# EasyEDA Pro project 射频跟随.epro

# Schematic Schematic7
Board Name: 射频跟随; Create Date: 2025-07-16; Page Name: P1; Project Name: 直流偏置电路; Schematic Name: Schematic7; Update Date: 2025-07-16; Company: 嘉立创EDA; Page Size: A4; Version: V1.0
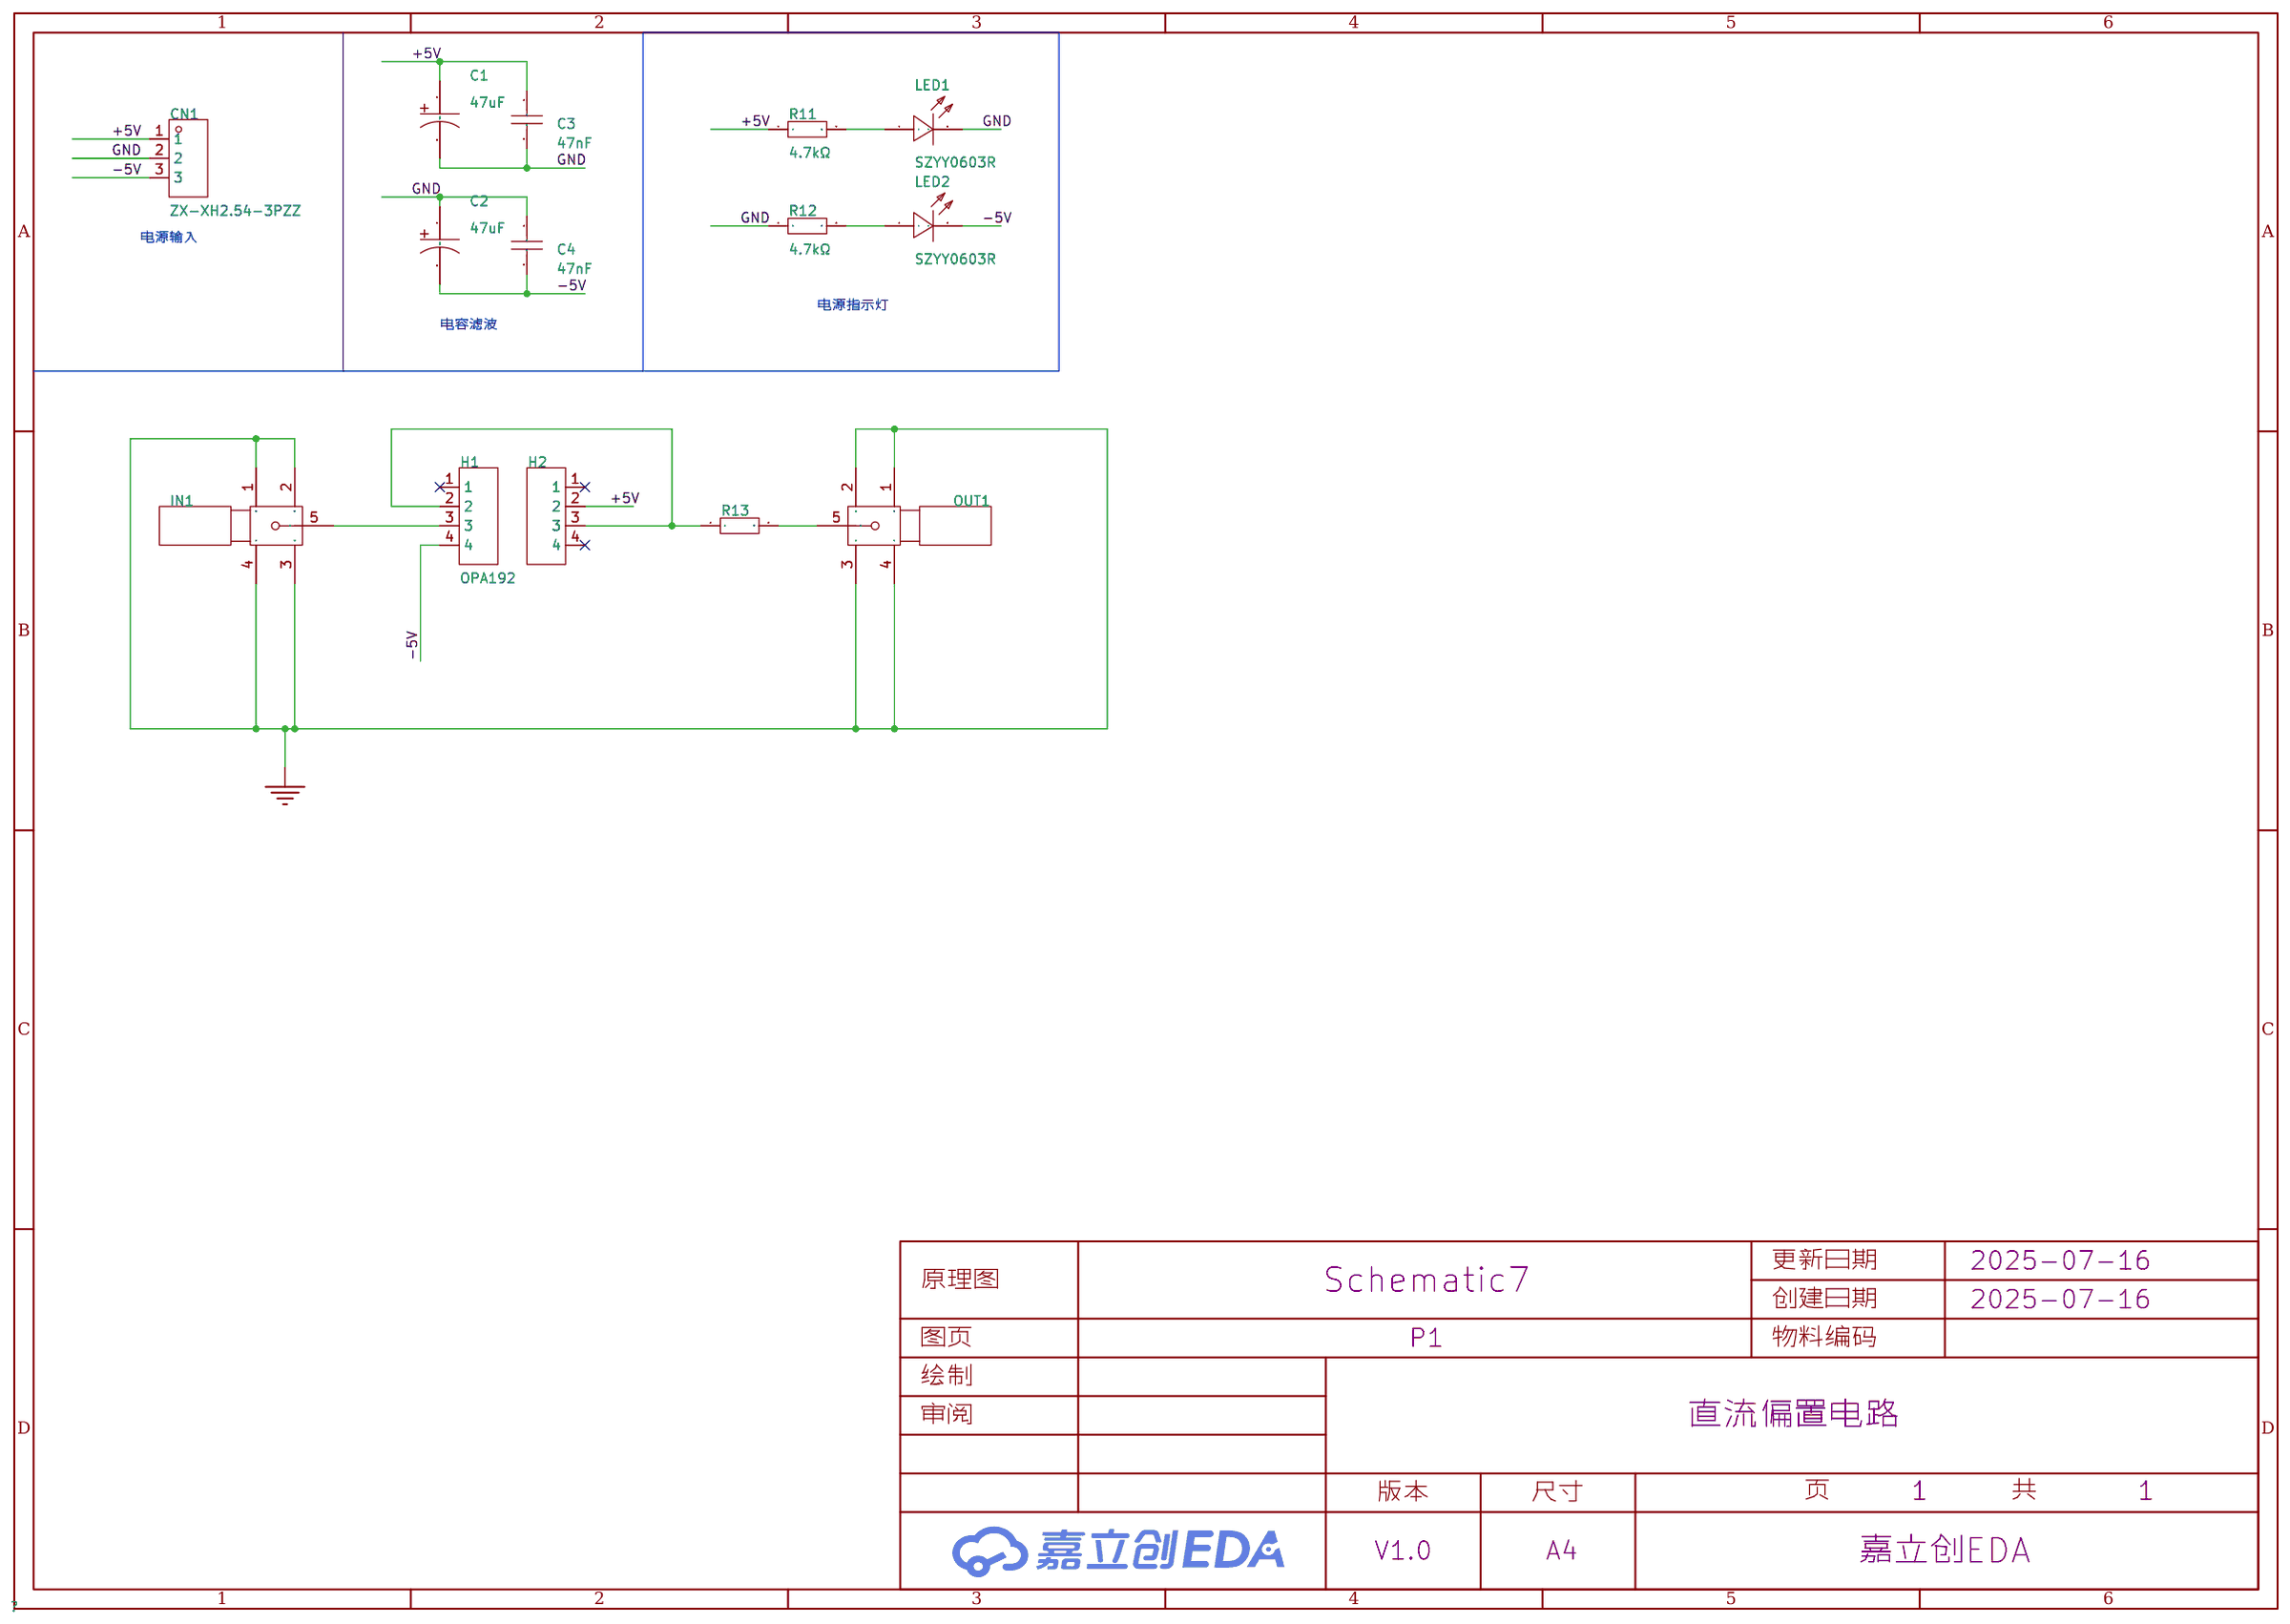
[diagram p0: schematic sheet]

## Parts
C1  47uF  [CAP-TH_BD5.0-P2.00-D0.8-FD]
C2  47uF  [CAP-TH_BD5.0-P2.00-D0.8-FD]
C3  47nF  [C0805]
C4  47nF  [C0805]
CN1  ZX-XH2.54-3PZZ  [CONN-TH_3P-P2.54_2501S-3P]
H1  OPA192  [HDR-TH_4P-P2.54-V-F]
H2  HC-PM254-5.0H-1x4PZ-02A  [HDR-TH_4P-P2.54-V-F]
IN1  -  [SMA-SMD_BWSMA-KE-P001]
LED1  SZYY0603R  [LED0603-R-RD]
LED2  SZYY0603R  [LED0603-R-RD]
OUT1  -  [SMA-SMD_BWSMA-KE-P001]
R11  4.7kΩ  [R0805]
R12  4.7kΩ  [R0805]
R13  0805W8F200JT5E  [R0805]

## Library data of the parts
C1 C2 = NXB25V47M5*11 2.5TP: 容值:47uF;精度:±20%;额定电压:25V;纹波电流:250mA@100kHz;等效串联电阻(ESR):300mΩ@100kHz;; LCSC Part Name: 47uF ±20% 25V; Supplier Part: C371230; Manufacturer: SAMYOUNG(韩国三莹); Supplier Footprint: 插件,D5xL11mm; JLCPCB Part Class: 扩展库; Datasheet: https://atta.szlcsc.com/upload/public/pdf/source/20190227/C371244_FA85FFEFC2961227CF12E3CCE8C34A7D.pdf; Supplier: LCSC; Tolerance: ±20%; Voltage Rating: 25V; Ripple Current: 250mA@100kHz; Equivalent Series Resistance(ESR): 300mΩ@100kHz; Pin Spacing: 2mm; Diameter: 5mm; Height - Seated (Max): 11mm; Lifetime: 2000hrs@105℃; Operating Temperature: -40℃~+105℃
C3 C4 = CL21B473KBCNNNC: 容值:47nF;精度:±10%;额定电压:50V;材质(温度系数):X7R;; LCSC Part Name: 47nF ±10% 50V; Supplier Part: C53134; Manufacturer: SAMSUNG(三星); Supplier Footprint: 0805; JLCPCB Part Class: 基础库; Datasheet: https://atta.szlcsc.com/upload/public/pdf/source/20160218/1457707763339.pdf; Supplier: LCSC; Tolerance: ±10%; Voltage Rated: 50V; Temperature Coefficient: X7R
CN1 = ZX-XH2.54-3PZZ: 插针结构:1x3P;间距:2.5mm;安装方式:直插;参考系列:XH;总PIN数:3P;排数:1;每排PIN数:3;行距:-;额定电流:3A;触头材质:黄铜;触头镀层:锡;工作温度范围:-25℃~+85℃;; LCSC Part Name: 1x3P 间距:2.5mm 直插 系列:XH; Supplier Part: C7429633; Manufacturer: Megastar(兆星); Supplier Footprint: 插件,P=2.5mm; JLCPCB Part Class: 扩展库; Datasheet: https://atta.szlcsc.com/upload/public/pdf/source/20230619/AE17037A2CFDBE8D9CBA775D61AD0A84.pdf; Supplier: LCSC; Pins Structure: 1x3P; Pitch: 2.5mm; Mounting Type: 直插; Reference Series: XH; Number of Pins: 3P; Number of Rows: 1; Number of PINs Per Row: 3; Rated Current: 3A; Contact Material: 黄铜; Contact Plating: 锡; Operating Temperature: -25℃~+85℃; Rated Voltage (Max): 250V; Plastic Material: PA66; Flame Retardant Rating: UL94V-0; Color: 白色; Z-Height of the Board: 7mm; X-Length of Bottom Edge on Board (Spacing Line): 10mm; Y-Width of Bottom Edge on Board: 5.9mm
H1 H2 = HC-PM254-5.0H-1x4PZ-02A: 插孔结构:1x4P;间距:2.54mm;行距:-;圆孔/方孔:方孔;安装方式:直插;排数:单排;总孔位数:4P;额定电流:3A;额定电压:-;插孔方向:顶部;塑高:5mm;触头材质:黄铜;触头镀层:金;工作温度:-40℃~+105℃;; LCSC Part Name: 间距2.54mm 1x4Pin 直插 PC3.0 H5.0; Supplier Part: C42163122; Manufacturer: HC(虹成电子); Supplier Footprint: 插件,P=2.54mm; JLCPCB Part Class: 扩展库; Datasheet: https://atta.szlcsc.com/upload/public/pdf/source/20250106/870D311C77C3B94D4AECF0B9EEDDA243.pdf; Supplier: LCSC; Holes Structure: 1x4P; Pitch: 2.54mm; Circular Hole / Square Hole: 方孔; Mounting Type: 直插; Number of Rows: 单排; Number of Positions: 4P; Current Rating: 3A; Holes Direction: 顶部; Insulation Height: 5mm; Contact Material: 黄铜; Contact Plating: 金; Operating Temperature: -40℃~+105℃; PIN Length: 3mm
IN1 OUT1 = BWSMA-KE-P001: 连接器类型:板端;接口类型:内孔;端口数量:1;接口直径:5.2mm;接口长度/高度:-;频率:-;射频系列:SMA;阻抗:50Ω;样式:偏脚;工作温度:-;; LCSC Part Name: 内孔 SMA 偏脚; Supplier Part: C496550; Manufacturer: BAT WIRELESS(蝙蝠无线); Supplier Footprint: SMD; JLCPCB Part Class: 扩展库; Datasheet: https://atta.szlcsc.com/upload/public/pdf/source/20240320/28FD502871C976DFF213ABFCF2A0ED51.pdf; Supplier: LCSC; Connector Type: 板端; Interface: 内孔; Number of Ports: 1; Interface Diameter: 5.2mm; RF Series: SMA; Impedance: 50Ω; Style: 偏脚
LED1 LED2 = SZYY0603R: 发光颜色:红色;功率:40mW;正向电流:20mA;主波长:615nm~630nm;二极管配置:-;透镜颜色:无色透明透镜;色温:-;发光角度:120°;载带方式:-;工作温度:-40℃~+85℃;; LCSC Part Name: 红灯; Supplier Part: C434419; Manufacturer: yongyu(永裕光电); Supplier Footprint: 0603; JLCPCB Part Class: 扩展库; Datasheet: https://atta.szlcsc.com/upload/public/pdf/source/20191204/C434419_0B955C1F73FF88449D9A795B6FF49070.pdf; Supplier: LCSC; Emitted Color: 红色; Power Dissipation: 40mW; Forward Current: 20mA; Dominant Wavelength: 615nm~630nm; Peak Wavelength: 645nm; Lens Color: 无色透明透镜; Viewing Angle: 120°; Operating Temperature: -40℃~+85℃
R11 R12 = 0805W8F4701T5E: 电阻类型:厚膜电阻;阻值:4.7kΩ;精度:±1%;功率:125mW;最大工作电压:150V;温度系数:±100ppm/℃;; LCSC Part Name: 4.7kΩ ±1% 125mW 厚膜电阻; Supplier Part: C17673; Manufacturer: UNI-ROYAL(厚声); Supplier Footprint: 0805; JLCPCB Part Class: 基础库; Datasheet: https://atta.szlcsc.com/upload/public/pdf/source/20200306/C422600_1E6D84923E4A46A82E41ADD87F860B5C.pdf; Supplier: LCSC; Type: 厚膜电阻; Tolerance: ±1%; Power(Watts): 125mW; Overload Voltage (Max): 150V; Temperature Coefficient: ±100ppm/℃; Operating Temperature Range: -55℃~+155℃
R13 = 0805W8F200JT5E: LCSC Part Name: 20Ω(20R0) ±1% 编带; Supplier Part: C17544; Manufacturer: UNI-ROYAL(厚声); Supplier Footprint: 0805; JLCPCB Part Class: Basic Part; Datasheet: https://atta.szlcsc.com/upload/public/pdf/source/20170920/C17544_1505887129854979902.pdf; Supplier: LCSC

## Nets
+5V: C1.1 C3.2 CN1.1 H2.2 R11.1
-5V: C2.2 C4.1 CN1.3 H1.4 LED2.2(-)
GND: C1.2 C2.1 C3.1 C4.2 CN1.2 IN1.1 IN1.2 IN1.3 IN1.4 LED1.2(-) OUT1.1 OUT1.2 OUT1.3 OUT1.4 R12.1
$1N415: LED2.1(+) R12.2
$1N573: H1.2 H2.3 R13.1
Net-(H1-3): H1.3 IN1.5
Net-(LED1-1): LED1.1(+) R11.2
Net-(OUT1-5): OUT1.5 R13.2

Not connected (* = marked no-connect by the designer): H1 1*; H2 1* 4*

## Notes on the sheet
- 电源输入
- 电源指示灯
- 电容滤波

# Board PCB7
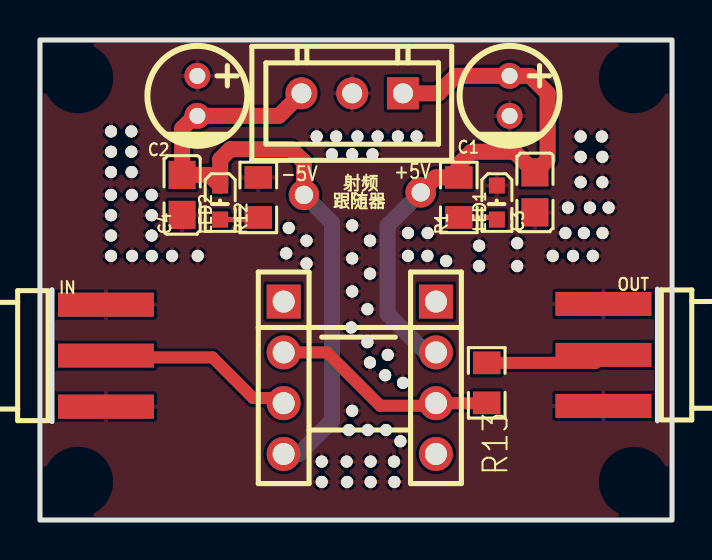
[diagram p1: board, top side]
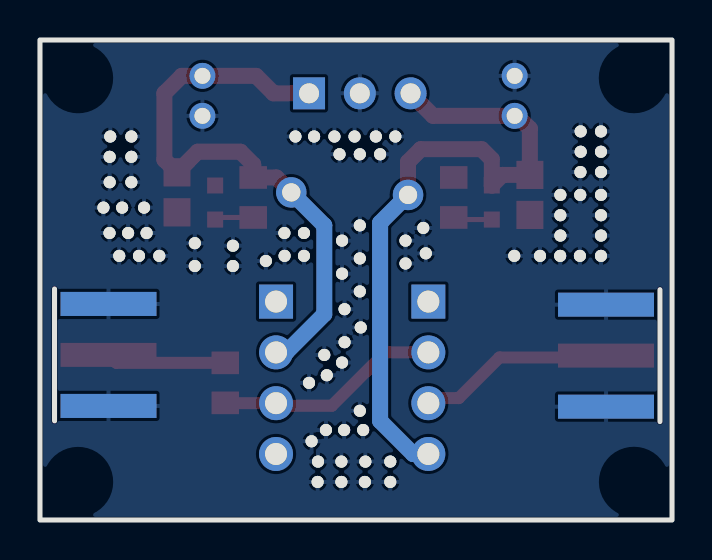
[diagram p2: board, bottom side, seen from below]

Outline 31.62 x 24 mm; copper layers: Top Layer, Bottom Layer. Coordinates in mm from the lower left corner of the outline.
Outline path: rectangle 0,24 31.62,0
Stack: Top Layer 0.035mm / Dielectric1 1.51mm FR4 er 4.5 / Bottom Layer 0.035mm

## Design rules (mm)
template: JLCPCB Capability(Two Layers Board)
spacing copperThickness1oz (default): track to track 0.102, other pairs 0.152 to 0.3
spacing copperThickness2oz: track to track 0.203, other pairs 0.152 to 0.3
track width copperThickness1oz (default): min 0.127, default 0.254, max 2.54
track width copperThickness2oz: min 0.203, default 0.254, max 2.54
differential pair differentialPair (default): width min 0.127, default 0.254, max 2.54; gap min 0.152, default 0.152
via viaSize (default): diameter min 0.5, default 0.61, max 10; hole min 0.3, default 0.305, max 6.3

## Placement (name value [footprint] x y rotation side)
C1  47uF  [CAP-TH_BD5.0-P2.00-D0.8-FD]  23.5 21.21 270 top
C2  47uF  [CAP-TH_BD5.0-P2.00-D0.8-FD]  7.87 21.21 270 top
C3  47nF  [C0805]  24.77 16.38 90 top
C4  47nF  [C0805]  7.11 16.26 270 top
CN1  ZX-XH2.54-3PZZ  [CONN-TH_3P-P2.54_2501S-3P]  15.62 21.34 180 top
H1  OPA192  [HDR-TH_4P-P2.54-V-F]  12.19 7.11 270 top
H2  HC-PM254-5.0H-1x4PZ-02A  [HDR-TH_4P-P2.54-V-F]  19.81 7.11 270 top
IN  -  [SMA-SMD_BWSMA-KE-P001]  3.3 8.22 180 top
LED1  SZYY0603R  [LED0603-R-RD]  22.86 15.88 270 top
LED2  SZYY0603R  [LED0603-R-RD]  9.02 15.88 270 top
NOREF  -  [Pad_e98]  16.38 8.89 0 top
NOREF#2  -  [Pad_e131]  27.05 16.89 0 top
NOREF#3  -  [Pad_e119]  19.05 16.38 0 top
NOREF#4  -  [Pad_e85]  14.1 2.92 0 top
NOREF#5  -  [Pad_e72]  5.59 14.22 0 top
NOREF#6  -  [Pad_e122]  20.32 12.95 0 top
NOREF#7  -  [Pad_e74]  5.59 16.26 0 top
NOREF#8  -  [Pad_e99]  16.38 10.54 0 top
NOREF#9  -  [Pad_e88]  15.34 2.92 0 top
NOREF#10  -  [Pad_e109]  17.32 4.5 0 top
NOREF#11  -  [Pad_e92]  15.62 14.73 0 top
NOREF#12  -  [Pad_e63]  3.56 13.21 0 top
NOREF#13  -  [Pad_e139]  28.14 18.16 0 top
NOREF#14  -  [Pad_e94]  15.62 5.46 0 top
NOREF#15  -  [Pad_e103]  16.51 12.32 0 top
NOREF#16  -  [Pad_e120]  19.38 13.21 0 top
NOREF#17  -  [Pad_e133]  27.05 19.18 0 top
NOREF#18  -  [Pad_e100]  16.4 4.5 0 top
NOREF#19  -  [Pad_e60]  3.56 16.26 0 top
NOREF#20  -  [Pad_e140]  28.14 14.35 0 top
NOREF#21  -  [Pad_e76]  6.6 13.21 0 top
NOREF#22  -  [Pad_e87]  14.82 19.18 0 top
NOREF#23  -  [Pad_e77]  7.89 13.21 0 top
NOREF#24  -  [Pad_e137]  28.11 19.18 0 top
NOREF#25  -  [Pad_e121]  19.39 14.35 0 top
NOREF#26  -  [Pad_e91]  15.57 9.63 0 top
NOREF#27  -  [Pad_e96]  15.62 11.43 0 top
NOREF#28  -  [Pad_e86]  14.6 18.29 0 top
NOREF#29  -  [Pad_e104]  16.54 2.92 0 top
NOREF#30  -  [Pad_e134]  27.21 14.35 0 top
NOREF#31  -  [Pad_e127]  25.65 13.21 0 top
NOREF#32  -  [Pad_e79]  12.45 14.61 0 top
NOREF#33  -  [Pad_e66]  3.56 19.43 0 top
NOREF#34  -  [Pad_e95]  15.62 18.29 0 top
NOREF#35  -  [Pad_e110]  17.4 8.25 0 top
NOREF#36  -  [Pad_e93]  15.62 13.08 0 top
NOREF#37  -  [Pad_e70]  4.59 16.26 0 top
NOREF#38  -  [Pad_e82]  13.34 13.97 0 top
NOREF#39  -  [Pad_e108]  17.27 7.24 0 top
NOREF#40  -  [Pad_e64]  3.56 15.24 0 top
NOREF#41  -  [Pad_e75]  5.6 13.21 0 top
NOREF#42  -  [Pad_e89]  15.37 1.91 0 top
NOREF#43  -  [Pad_e107]  16.89 19.18 0 top
NOREF#44  -  [Pad_e83]  13.84 19.18 0 top
NOREF#45  -  [Pad_e71]  4.61 13.21 0 top
NOREF#46  -  [Pad_e105]  16.54 1.91 0 top
NOREF#47  -  [Pad_e117]  18.41 14.35 0 top
NOREF#48  -  [Pad_e81]  13.34 12.83 0 top
NOREF#49  -  [Pad_e62]  3.56 18.41 0 top
NOREF#50  -  [Pad_e141]  28.45 15.62 0 top
NOREF#51  -  [Pad_e129]  26.42 15.62 0 top
NOREF#52  -  [Pad_e78]  12.32 13.33 0 top
NOREF#53  -  [Pad_e116]  18.41 13.21 0 top
NOREF#54  -  [Pad_e115]  18.16 6.86 0 top
NOREF#55  -  [Pad_e68]  4.57 18.41 0 top
NOREF#56  -  [Pad_e106]  16.64 18.29 0 top
NOREF#57  -  [Pad_e90]  15.45 4.5 0 top
NOREF#58  -  [Pad_e61]  3.56 17.4 0 top
NOREF#59  -  [Pad_e124]  21.97 13.72 0 top
NOREF#60  -  [Pad_e135]  27.51 15.62 0 top
NOREF#61  -  [Pad_e112]  17.73 1.91 0 top
NOREF#62  -  [Pad_e65]  3.56 14.22 0 top
NOREF#63  -  [Pad_e132]  27.05 18.16 0 top
NOREF#64  -  [Pad_e138]  28.14 16.89 0 top
NOREF#65  -  [Pad_e97]  15.88 19.18 0 top
NOREF#66  -  [Pad_e67]  4.57 19.43 0 top
NOREF#67  -  [Pad_e130]  26.67 13.21 0 top
NOREF#68  -  [Pad_e123]  21.97 12.7 0 top
NOREF#69  -  [Pad_e128]  26.29 14.35 0 top
NOREF#70  -  [Pad_e84]  14.1 1.91 0 top
NOREF#71  -  [Pad_e125]  23.88 12.7 0 top
NOREF#72  -  [Pad_e102]  16.51 13.97 0 top
NOREF#73  -  [Pad_e69]  4.58 17.4 0 top
NOREF#74  -  [Pad_e126]  23.88 13.84 0 top
NOREF#75  -  [Pad_e136]  27.66 13.21 0 top
NOREF#76  -  [Pad_e80]  13.21 16.26 0 top
NOREF#77  -  [Pad_e73]  5.59 15.24 0 top
NOREF#78  -  [Pad_e101]  16.51 7.87 0 top
NOREF#79  -  [Pad_e114]  18.03 3.94 0 top
NOREF#80  -  [Pad_e113]  17.91 19.18 0 top
NOREF#81  -  [Pad_e118]  18.84 19.18 0 top
NOREF#82  -  [Pad_e111]  17.71 2.92 0 top
OUT  -  [SMA-SMD_BWSMA-KE-P001]  28.19 8.25 0 top
R1  4.7kΩ  [R0805]  20.96 16.13 270 top
R12  4.7kΩ  [R0805]  10.92 16.13 270 top
R13  0805W8F200JT5E  [R0805]  22.35 6.86 90 top

## Footprints (pads in the part's own frame, mm; a bottom-side part is the same pattern mirrored in y, then rotated)
C0805
  rect 1.41x1.35 smd: 1(-1,0) 2(1,0)
CAP-TH_BD5.0-P2.00-D0.8-FD
  round 1.3 hole 0.8: 1(-1,0) 2(1,0)
CONN-TH_3P-P2.54_2501S-3P
  rect 1.6x1.6 hole 1: 1(-2.54,0)
  round 1.6 hole 1: 2(0,0) 3(2.54,0)
HDR-TH_4P-P2.54-V-F
  rect 1.7x1.7 hole 1.1: 1(-3.81,0)
  round 1.7 hole 1.1: 2(-1.27,0) 3(1.27,0) 4(3.81,0)
LED0603-R-RD
  rect 0.8x0.8 smd: 1(0.851,0) 2(-0.851,0)
Pad_e60
  round 0.6 hole 0.6: 1(0,0)
Pad_e61
  round 0.6 hole 0.6: 1(0,0)
Pad_e62
  round 0.6 hole 0.6: 1(0,0)
Pad_e63
  round 0.6 hole 0.6: 1(0,0)
Pad_e64
  round 0.6 hole 0.6: 1(0,0)
Pad_e65
  round 0.6 hole 0.6: 1(0,0)
Pad_e66
  round 0.6 hole 0.6: 1(0,0)
Pad_e67
  round 0.6 hole 0.6: 1(0,0)
Pad_e68
  round 0.6 hole 0.6: 1(0,0)
Pad_e69
  round 0.6 hole 0.6: 1(0,0)
Pad_e70
  round 0.6 hole 0.6: 1(0,0)
Pad_e71
  round 0.6 hole 0.6: 1(0,0)
Pad_e72
  round 0.6 hole 0.6: 1(0,0)
Pad_e73
  round 0.6 hole 0.6: 1(0,0)
Pad_e74
  round 0.6 hole 0.6: 1(0,0)
Pad_e75
  round 0.6 hole 0.6: 1(0,0)
Pad_e76
  round 0.6 hole 0.6: 1(0,0)
Pad_e77
  round 0.6 hole 0.6: 1(0,0)
Pad_e78
  round 0.6 hole 0.6: 1(0,0)
Pad_e79
  round 0.6 hole 0.6: 1(0,0)
Pad_e80
  round 1.524 hole 0.914: 1(0,0)
Pad_e81
  round 0.6 hole 0.6: 1(0,0)
Pad_e82
  round 0.6 hole 0.6: 1(0,0)
Pad_e83
  round 0.6 hole 0.6: 1(0,0)
Pad_e84
  round 0.6 hole 0.6: 1(0,0)
Pad_e85
  round 0.6 hole 0.6: 1(0,0)
Pad_e86
  round 0.6 hole 0.6: 1(0,0)
Pad_e87
  round 0.6 hole 0.6: 1(0,0)
Pad_e88
  round 0.6 hole 0.6: 1(0,0)
Pad_e89
  round 0.6 hole 0.6: 1(0,0)
Pad_e90
  round 0.6 hole 0.6: 1(0,0)
Pad_e91
  round 0.6 hole 0.6: 1(0,0)
Pad_e92
  round 0.6 hole 0.6: 1(0,0)
Pad_e93
  round 0.6 hole 0.6: 1(0,0)
Pad_e94
  round 0.6 hole 0.6: 1(0,0)
Pad_e95
  round 0.6 hole 0.6: 1(0,0)
Pad_e96
  round 0.6 hole 0.6: 1(0,0)
Pad_e97
  round 0.6 hole 0.6: 1(0,0)
Pad_e98
  round 0.6 hole 0.6: 1(0,0)
Pad_e99
  round 0.6 hole 0.6: 1(0,0)
Pad_e100
  round 0.6 hole 0.6: 1(0,0)
Pad_e101
  round 0.6 hole 0.6: 1(0,0)
Pad_e102
  round 0.6 hole 0.6: 1(0,0)
Pad_e103
  round 0.6 hole 0.6: 1(0,0)
Pad_e104
  round 0.6 hole 0.6: 1(0,0)
Pad_e105
  round 0.6 hole 0.6: 1(0,0)
Pad_e106
  round 0.6 hole 0.6: 1(0,0)
Pad_e107
  round 0.6 hole 0.6: 1(0,0)
Pad_e108
  round 0.6 hole 0.6: 1(0,0)
Pad_e109
  round 0.6 hole 0.6: 1(0,0)
Pad_e110
  round 0.6 hole 0.6: 1(0,0)
Pad_e111
  round 0.6 hole 0.6: 1(0,0)
Pad_e112
  round 0.6 hole 0.6: 1(0,0)
Pad_e113
  round 0.6 hole 0.6: 1(0,0)
Pad_e114
  round 0.6 hole 0.6: 1(0,0)
Pad_e115
  round 0.6 hole 0.6: 1(0,0)
Pad_e116
  round 0.6 hole 0.6: 1(0,0)
Pad_e117
  round 0.6 hole 0.6: 1(0,0)
Pad_e118
  round 0.6 hole 0.6: 1(0,0)
Pad_e119
  round 1.524 hole 0.914: 1(0,0)
Pad_e120
  round 0.6 hole 0.6: 1(0,0)
Pad_e121
  round 0.6 hole 0.6: 1(0,0)
Pad_e122
  round 0.6 hole 0.6: 1(0,0)
Pad_e123
  round 0.6 hole 0.6: 1(0,0)
Pad_e124
  round 0.6 hole 0.6: 1(0,0)
Pad_e125
  round 0.6 hole 0.6: 1(0,0)
Pad_e126
  round 0.6 hole 0.6: 1(0,0)
Pad_e127
  round 0.6 hole 0.6: 1(0,0)
Pad_e128
  round 0.6 hole 0.6: 1(0,0)
Pad_e129
  round 0.6 hole 0.6: 1(0,0)
Pad_e130
  round 0.6 hole 0.6: 1(0,0)
Pad_e131
  round 0.6 hole 0.6: 1(0,0)
Pad_e132
  round 0.6 hole 0.6: 1(0,0)
Pad_e133
  round 0.6 hole 0.6: 1(0,0)
Pad_e134
  round 0.6 hole 0.6: 1(0,0)
Pad_e135
  round 0.6 hole 0.6: 1(0,0)
Pad_e136
  round 0.6 hole 0.6: 1(0,0)
Pad_e137
  round 0.6 hole 0.6: 1(0,0)
Pad_e138
  round 0.6 hole 0.6: 1(0,0)
Pad_e139
  round 0.6 hole 0.6: 1(0,0)
Pad_e140
  round 0.6 hole 0.6: 1(0,0)
Pad_e141
  round 0.6 hole 0.6: 1(0,0)
R0805
  rect 1.133x1.377 smd: 1(-1,0) 2(1,0)
SMA-SMD_BWSMA-KE-P001
  rect 4.8x1.2 smd: 1(0,-2.55) 2(0,2.55) 5(0,0)
  rect 4.8x1.2 smd far side: 3(0,2.55) 4(0,-2.55)

## Nets
+5V: C1.1 C3.2 CN1.1 H2.2 NOREF#3.1 R1.1
-5V: C2.2 C4.1 CN1.3 H1.4 LED2.2 NOREF#76.1
GND: C1.2 C2.1 C3.1 C4.2 CN1.2 IN.1 IN.2 IN.3 IN.4 LED1.2 NOREF.1 NOREF#2.1 NOREF#4.1 NOREF#5.1 NOREF#6.1 NOREF#7.1 NOREF#8.1 NOREF#9.1 NOREF#10.1 NOREF#11.1 NOREF#12.1 NOREF#13.1 NOREF#14.1 NOREF#15.1 NOREF#16.1 NOREF#17.1 NOREF#18.1 NOREF#19.1 NOREF#20.1 NOREF#21.1 NOREF#22.1 NOREF#23.1 NOREF#24.1 NOREF#25.1 NOREF#26.1 NOREF#27.1 NOREF#28.1 NOREF#29.1 NOREF#30.1 NOREF#31.1 NOREF#32.1 NOREF#33.1 NOREF#34.1 NOREF#35.1 NOREF#36.1 NOREF#37.1 NOREF#38.1 NOREF#39.1 NOREF#40.1 NOREF#41.1 NOREF#42.1 NOREF#43.1 NOREF#44.1 NOREF#45.1 NOREF#46.1 NOREF#47.1 NOREF#48.1 NOREF#49.1 NOREF#50.1 NOREF#51.1 NOREF#52.1 NOREF#53.1 NOREF#54.1 NOREF#55.1 NOREF#56.1 NOREF#57.1 NOREF#58.1 NOREF#59.1 NOREF#60.1 NOREF#61.1 NOREF#62.1 NOREF#63.1 NOREF#64.1 NOREF#65.1 NOREF#66.1 NOREF#67.1 NOREF#68.1 NOREF#69.1 NOREF#70.1 NOREF#71.1 NOREF#72.1 NOREF#73.1 NOREF#74.1 NOREF#75.1 NOREF#77.1 NOREF#78.1 NOREF#79.1 NOREF#80.1 NOREF#81.1 NOREF#82.1 OUT.1 OUT.2 OUT.3 OUT.4 R12.1
$1N415: LED2.1 R12.2
$1N416: LED1.1 R1.2
$1N567: H1.3 IN.5
$1N573: H1.2 H2.3 R13.1
$1N713: OUT.5 R13.2

Pads without a net: H1 1; H2 1 4

## Routing (per net, layer and track width the routed paths; a pad name or vN(x,y) marks a point on that pad's centre or on a via; arc(x,y) is an arc through that point)
+5V: length 29.5
  Top Layer w0.8: NOREF#3.1 19.8,17.13 R1.1 20.96,17.78 21.59,18.41 23.73,18.41 C3.2 25.4,18.02 25.4,21.34 24.53,22.21 C1.1 20.81,22.21 19.94,21.34 CN1.1
  Bottom Layer w0.8: H2.2 19.3,8.38 17.4,10.29 17.4,14.73 NOREF#3.1
-5V: length 33.7
  Top Layer w0.8: NOREF#76.1 13.21,17.91 12.57,18.54 9.53,18.54 9.02,18.03 LED2.2 8.49,17.26 C4.1 7.11,19.57 7.75,20.21 11.95,20.21 CN1.3
  Bottom Layer w0.8: H1.4 12.95,3.3 14.6,4.95 14.6,14.86 NOREF#76.1
$1N415: length 1.9
  Top Layer w0.254: R12.2 10.82,15.02 LED2.1
$1N416: length 1.9
  Top Layer w0.254: R1.2 22.75,15.13 LED1.1
$1N567: length 9.2
  Top Layer w0.6: H1.3 11.94,6.1 10.67,6.1 8.64,8.13 4.03,8.13 3.94,8.22
$1N573: length 11.3
  Top Layer w0.6: H1.2 14.35,8.38 17.02,5.72 19.69,5.72 H2.3 22.34,5.84 R13.1
$1N713: length 6
  Top Layer w0.6: OUT.5 27.8,7.86 R13.2

## Copper pours and planes (outline as drawn; the poured copper is in the pictures)
GND on Top Layer: -0.13,24 31.62,24 31.62,0 -0.13,0
GND on Bottom Layer: 0,24.13 31.62,24.13 31.62,0 0,0

## Text on the board
Top Silkscreen Layer: -5V | +5V | 跟随器 | 射频
